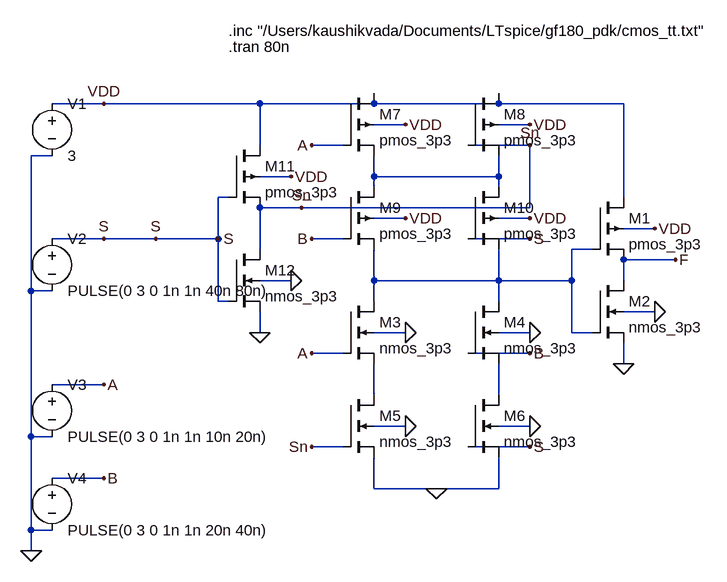
[diagram p0: schematic Q2_7.asc]
Q2_7.asc, the LTspice schematic file:
Version 4
SHEET 1 1200 900
WIRE 80 64 160 64
WIRE 80 144 48 144
WIRE 48 144 48 352
WIRE 80 272 160 272
WIRE 80 352 48 352
WIRE 48 352 48 576
WIRE 80 496 160 496
WIRE 80 576 48 576
WIRE 48 576 48 720
WIRE 80 640 160 640
WIRE 80 720 48 720
WIRE 48 720 48 752
WIRE 160 64 400 64
WIRE 400 64 576 64
WIRE 576 64 768 64
WIRE 768 64 960 64
WIRE 400 64 400 128
WIRE 160 272 240 272
WIRE 240 272 336 272
WIRE 336 208 336 272
WIRE 336 208 352 208
WIRE 336 272 336 368
WIRE 336 368 352 368
WIRE 400 176 448 176
WIRE 400 224 400 288
WIRE 400 224 464 224
WIRE 464 224 816 224
WIRE 816 224 816 128
WIRE 400 336 448 336
WIRE 400 384 400 416
WIRE 576 64 576 48
WIRE 768 64 768 48
WIRE 576 144 576 176
WIRE 768 144 768 176
WIRE 576 176 768 176
WIRE 576 192 576 176
WIRE 768 192 768 176
WIRE 576 288 576 336
WIRE 768 288 768 336
WIRE 576 336 768 336
WIRE 768 336 880 336
WIRE 576 368 576 336
WIRE 768 368 768 336
WIRE 576 464 576 512
WIRE 768 464 768 512
WIRE 576 608 576 656
WIRE 768 608 768 656
WIRE 576 656 768 656
WIRE 480 128 528 128
WIRE 720 128 816 128
WIRE 480 272 528 272
WIRE 720 272 816 272
WIRE 480 448 528 448
WIRE 720 448 816 448
WIRE 480 592 528 592
WIRE 720 592 816 592
WIRE 576 96 624 96
WIRE 768 96 816 96
WIRE 576 240 624 240
WIRE 768 240 816 240
WIRE 576 416 624 416
WIRE 768 416 816 416
WIRE 576 560 624 560
WIRE 768 560 816 560
WIRE 960 64 960 208
WIRE 880 288 880 336
WIRE 880 336 880 416
WIRE 880 288 912 288
WIRE 880 416 912 416
WIRE 960 304 960 336
WIRE 960 304 1040 304
WIRE 960 432 960 464
WIRE 960 256 1008 256
WIRE 960 384 1008 384
FLAG 48 752 0
FLAG 160 272 S
FLAG 160 496 A
FLAG 160 640 B
FLAG 160 64 VDD
FLAG 464 224 Sn
FLAG 240 272 S
FLAG 336 272 S
FLAG 448 176 VDD
FLAG 448 336 0
FLAG 400 416 0
FLAG 624 96 VDD
FLAG 816 96 VDD
FLAG 624 240 VDD
FLAG 816 240 VDD
FLAG 624 416 0
FLAG 816 416 0
FLAG 624 560 0
FLAG 816 560 0
FLAG 672 656 0
FLAG 480 128 A
FLAG 816 128 Sn
FLAG 480 272 B
FLAG 816 272 S
FLAG 480 448 A
FLAG 816 448 B
FLAG 480 592 Sn
FLAG 816 592 S
FLAG 1040 304 F
FLAG 960 464 0
FLAG 1008 256 VDD
FLAG 1008 384 0
SYMBOL voltage 80 48 R0
SYMATTR InstName V1
SYMATTR Value 3
SYMBOL voltage 80 256 R0
SYMATTR InstName V2
SYMATTR Value PULSE(0 3 0 1n 1n 40n 80n)
SYMBOL voltage 80 480 R0
SYMATTR InstName V3
SYMATTR Value PULSE(0 3 0 1n 1n 10n 20n)
SYMBOL voltage 80 624 R0
SYMATTR InstName V4
SYMATTR Value PULSE(0 3 0 1n 1n 20n 40n)
SYMBOL pmos4 352 128 R0
SYMATTR InstName M11
SYMATTR Value pmos_3p3
SYMATTR SpiceLine W=4u L=1u
SYMBOL nmos4 352 288 R0
SYMATTR InstName M12
SYMATTR Value nmos_3p3
SYMATTR SpiceLine W=2u L=1u
SYMBOL pmos4 528 48 R0
SYMATTR InstName M7
SYMATTR Value pmos_3p3
SYMATTR SpiceLine W=4u L=1u
SYMBOL pmos4 720 48 R0
SYMATTR InstName M8
SYMATTR Value pmos_3p3
SYMATTR SpiceLine W=4u L=1u
SYMBOL pmos4 528 192 R0
SYMATTR InstName M9
SYMATTR Value pmos_3p3
SYMATTR SpiceLine W=4u L=1u
SYMBOL pmos4 720 192 R0
SYMATTR InstName M10
SYMATTR Value pmos_3p3
SYMATTR SpiceLine W=4u L=1u
SYMBOL nmos4 528 368 R0
SYMATTR InstName M3
SYMATTR Value nmos_3p3
SYMATTR SpiceLine W=2u L=1u
SYMBOL nmos4 720 368 R0
SYMATTR InstName M4
SYMATTR Value nmos_3p3
SYMATTR SpiceLine W=2u L=1u
SYMBOL nmos4 528 512 R0
SYMATTR InstName M5
SYMATTR Value nmos_3p3
SYMATTR SpiceLine W=2u L=1u
SYMBOL nmos4 720 512 R0
SYMATTR InstName M6
SYMATTR Value nmos_3p3
SYMATTR SpiceLine W=2u L=1u
SYMBOL pmos4 912 208 R0
SYMATTR InstName M1
SYMATTR Value pmos_3p3
SYMATTR SpiceLine W=4u L=1u
SYMBOL nmos4 912 336 R0
SYMATTR InstName M2
SYMATTR Value nmos_3p3
SYMATTR SpiceLine W=2u L=1u
TEXT 352 -48 Left 2 !.inc "/Users/kaushikvada/Documents/LTspice/gf180_pdk/cmos_tt.txt"
TEXT 352 -24 Left 2 !.tran 80n

The netlist it stands for:
* Q2_7.asc
V1 VDD 0 3
V2 S 0 PULSE(0 3 0 1n 1n 40n 80n)
V3 A 0 PULSE(0 3 0 1n 1n 10n 20n)
V4 B 0 PULSE(0 3 0 1n 1n 20n 40n)
M11 VDD S Sn VDD pmos_3p3 W=4u L=1u
M12 Sn S 0 0 nmos_3p3 W=2u L=1u
M7 VDD A N001 VDD pmos_3p3 W=4u L=1u
M8 VDD Sn N001 VDD pmos_3p3 W=4u L=1u
M9 N001 B N002 VDD pmos_3p3 W=4u L=1u
M10 N001 S N002 VDD pmos_3p3 W=4u L=1u
M3 N002 A N003 0 nmos_3p3 W=2u L=1u
M4 N002 B N004 0 nmos_3p3 W=2u L=1u
M5 N003 Sn 0 0 nmos_3p3 W=2u L=1u
M6 N004 S 0 0 nmos_3p3 W=2u L=1u
M1 VDD N002 F VDD pmos_3p3 W=4u L=1u
M2 F N002 0 0 nmos_3p3 W=2u L=1u
.model NMOS NMOS
.model PMOS PMOS
.lib standard.mos
.inc "/Users/kaushikvada/Documents/LTspice/gf180_pdk/cmos_tt.txt"
.tran 80n
.backanno
.end